# Altium project ESP_Dent.PrjPcb (part 2 of 3)
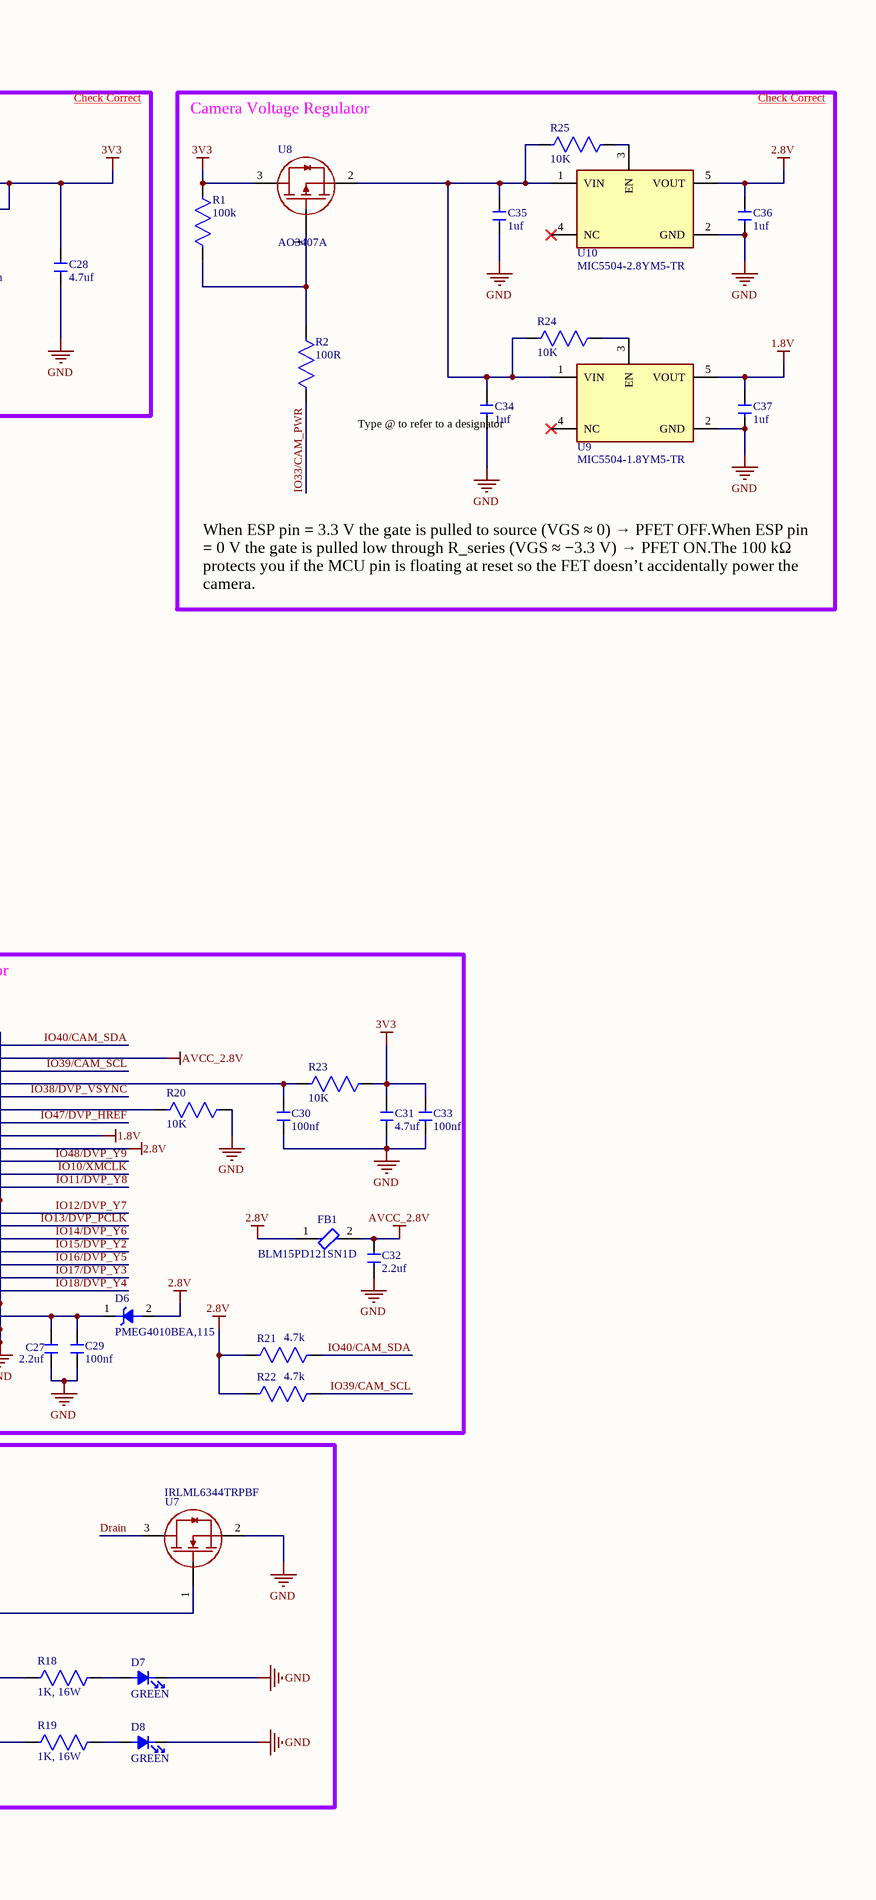
[diagram p2: Dent_Sheet_ESP.SchDoc, right]

## Sheet Dent_Sheet_ESP.SchDoc (continued)
### Library data of the parts
C1 C2 C9 C11 C12 C15-C17 C19 C21 C23 C24 C29 C30 C33 = 100nf: CAP CER 100NF 10V X7R 0402; Manufacturer: Samsung; Manufacturer Part Number: CL05B104KP5VPNC; Material: 4241ConductorMaterial; Tolerance: 10%; Supplier: Digikey; Supplier Part Number: 1276-CL05B104KP5VPNCCT-ND; RoHS: Yes; Category: Ceramic Capacitors; Stock: 98704; Pricing: 1=0.1, 10=0.037, 50=0.0248, 100=0.0212, 500=0.0159, 1000=0.01341, 2500=0.01148, 5000=0.01032 (USD); Case/Package: 343Case; Min Operating Temperature: -55°C; Max Operating Temperature: 125°C; Value: 100nF; Voltage Rating: 10V; Height: 550um; RoHS Compliant: Yes; LCSC Part No.: C16193311
C3 = CMP-2010-01082-2: Chip Multilayer Ceramic Capacitors for General Purpose, 0201, 1.1pF, C0G, 30ppm/°C, 0.1pF, 50V; Case/Package: 0201; Mount: Surface Mount; Max Operating Temperature: 125°C; Width: 0.3mm; Height: 0.3mm; Length: 0.024inch; Voltage Rating: 50V; Case Code (Metric): 0603; Package Quantity: 15000; Thickness: 0.013inch; Case Code (Imperial): 0201; Capacitance: 1.1pF; Packaging: Tape and Reel; Voltage Rating (DC): 50V; Min Operating Temperature: -55°C; Dielectric: C0G; Termination: SMD/SMT; LCSC Part No.: C384969; Value: 1.1pF
C4 = CMP-2010-00924-2: Ceramic Capacitor 0.9pF ±0.05pF 25V C0G 0201 (0603 Metric); Package Quantity: 15000; Dielectric: C0G; Voltage Rating: 25V; Voltage Rating (DC): 25V; Length: 0.024inch; Max Operating Temperature: 125°C; Case Code (Imperial): 0201; Width: 0.012inch; Termination: SMD/SMT; Mount: Surface Mount; Packaging: Tape and Reel; Radiation Hardening: No; Case/Package: 0201; Thickness: 0.013inch; Capacitance: 0.9pF; Case Code (Metric): 0603; Depth: 0.3mm; Height: 0.3mm; Min Operating Temperature: -55°C; LCSC Part No.: C471401; Value: 0.9pF
C7 C18 = 10nf: CAP CER 10000PF 50V X7R 0402; Manufacturer: Samsung; Manufacturer Part Number: CL05B103KB5NNNC; Material: Ceramic; Tolerance: 10%; Supplier: Digikey; Supplier Part Number: 1276-1028-1-ND; RoHS: Yes; Category: Ceramic Capacitors; Stock: 192666; Pricing: 1=0.08, 10=0.002 (USD); Mounting Technology: Surface Mount; Case/Package: 0402; Case Code (Metric): 1005; Case Code (Imperial): 0402; Min Operating Temperature: -55°C; Max Operating Temperature: 125°C; Packaging: Tape and Reel; Value: 10nF; Package Quantity: 1; Voltage Rating: 50V; Dielectric: X7R; Voltage: 50V; Series: CL; Construction: Flat; Voltage Rating (DC): 50V; Length: 1mm; Width: 0.02inch; Height: 0.5mm; Thickness: 0.022inch; Depth: 0.5mm; Radiation Hardening: No; RoHS Compliant: Yes; Lead Free: 5697LeadFree; ComponentLink1URL: https://datasheet.ciiva.com/15195/getdatasheetpartid-359682-15195636.pdf?src-supplier=Verical; ComponentLink1Description: https://datasheet.ciiva.com/15195/getdatasheetpartid-359682-15195636.pdf?src-supplier=Verical; ComponentLink2URL: https://datasheet.ciiva.com/29198/458761-da-01-en-vs-kondensator-0402-29198432.pdf?src-supplier=Conrad; ComponentLink2Description: https://datasheet.ciiva.com/29198/458761-da-01-en-vs-kondensator-0402-29198432.pdf?src-supplier=Conrad; ComponentLink3URL: https://datasheet.ciiva.com/26309/mlcc-catalogdownload2013-eng-26309005.pdf?src-supplier=Distrelec; ComponentLink3Description: https://datasheet.ciiva.com/26309/mlcc-catalogdownload2013-eng-26309005.pdf?src-supplier=Distrelec; LCSC Part No.: C15195
C8 C10 C14 C27 C32 = 2.2uf: CAP CER 2.2UF 10V X5R 0402; Manufacturer: Samsung; Manufacturer Part Number: CL05A225KP5NSNC; Material: 4241ConductorMaterial; Supplier: Digikey; Supplier Part Number: 1276-1108-1-ND; RoHS: Yes; Category: Ceramic Capacitors; Pricing: 1=0.13, 10=0.072, 50=0.0504, 100=0.0437, 500=0.0325, 1000=0.02908, 2500=0.02547, 5000=0.0233 (USD); ComponentLink1URL: https://datasheet.ciiva.com/26838/getdatasheetpartid-358634-26838179.pdf?src-supplier=Verical; ComponentLink1Description: https://datasheet.ciiva.com/26838/getdatasheetpartid-358634-26838179.pdf?src-supplier=Verical; ComponentLink2URL: https://datasheet.ciiva.com/25794/cl05a225kp5nsnc-25794439.pdf?src-supplier=Digikey; ComponentLink2Description: https://datasheet.ciiva.com/25794/cl05a225kp5nsnc-25794439.pdf?src-supplier=Digikey; LCSC Part No.: C107369
C13 C34-C37 = 1uf: CAP CER 1UF 25V X5R 0402; Manufacturer: Samsung; Manufacturer Part Number: CL05A105KA5NQNC; Dielectric Material: Ceramic; Multilayer: Yes; Tolerance  (fill in as +-): 10%; Supplier: Digikey; Supplier Part Number: 1276-1445-1-ND; RoHS: Yes; Category: Ceramic Capacitors; Stock: 704317; Pricing: 1=0.08, 10=0.03, 50=0.0214 (USD); Mounting Technology: Surface Mount; Pins: 2; Package Shape: Rectangular; Case/Package: 0402; Terminal Finish: Nickel; Min Operating Temperature: -55°C; Max Operating Temperature: 85°C; JESD-609 Code: e3; Value: 1uF; Capacitor Type: Ceramic; Package Style: SMTMeter; Packaging: Tape and Reel; Tolerance (fill in as +-): 10%; Rated DC Voltage (URdc): 25V; Temperature Characteristics Code: X5R; Termination: Wraparound; Length: 1mm; Width: 0.5mm; Height: 0.6mm; Reach SVHC Compliant: Yes; RoHS Compliant: Yes; ComponentLink1URL: https://datasheet.ciiva.com:443/pdfs/VipMasterIC/IC/SEMS/SEMS-S-A0008384515/SEMS-S-A0008872946-1.pdf?src-supplier=IHS+Markit; ComponentLink1Description: https://datasheet.ciiva.com:443/pdfs/VipMasterIC/IC/SEMS/SEMS-S-A0008384515/SEMS-S-A0008872946-1.pdf?src-supplier=IHS+Markit; ComponentLink2URL: https://datasheet.ciiva.com/25720/cl05a105ka5nqnc-25720771.pdf?src-supplier=Digikey; ComponentLink2Description: https://datasheet.ciiva.com/25720/cl05a105ka5nqnc-25720771.pdf?src-supplier=Digikey; ComponentLink3URL: https://datasheet.ciiva.com/3777/cl05a105ka5nqnc-3777709.pdf?src-supplier=Arrow+Electronics; ComponentLink3Description: https://datasheet.ciiva.com/3777/cl05a105ka5nqnc-3777709.pdf?src-supplier=Arrow+Electronics; ComponentLink4URL: https://datasheet.ciiva.com/29198/459147-da-01-en-vs-kondensator-0402-29198339.pdf?src-supplier=Conrad; ComponentLink4Description: https://datasheet.ciiva.com/29198/459147-da-01-en-vs-kondensator-0402-29198339.pdf?src-supplier=Conrad; LCSC Part No.: C52923
C20 C25 C28 C31 = 4.7uf: CAP CER 4.7UF 10V X5R 0402; Manufacturer: Samsung; Manufacturer Part Number: CL05A475KP5ZRNC; Supplier: DigiKey; Supplier Part Number: 1276-CL05A475KP5ZRNCCT-ND; RoHS: Yes; Stock: 56476; Pricing: 1=0.2, 10=0.114, 50=0.081, 100=0.0711, 500=0.05766, 1000=0.04912, 2500=0.04367, 5000=0.04039, 10000=0.035, 20000=0.03472, 30000=0.03435, 50000=0.03312, 70000=0.0324, 100000=0.0318 (USD); LCSC Part No.: C730428
C22 C26 = 24pf: CAP CER 24PF 50V C0G/NPO 0402; Manufacturer: Yageo; Manufacturer Part Number: CC0402GRNPO9BN240; Supplier: Digikey; Supplier Part Number: 311-3334-1-ND; RoHS: Yes; Category: Ceramic Capacitors; Stock: 9554; Pricing: 1=0.1, 10=0.041, 50=0.0278, 100=0.0239, 500=0.01724, 1000=0.0152, 2500=0.01306, 5000=0.01178 (USD); ComponentLink1URL: http://www.yageo.com/documents/recent/UPY-GP_NP0_16V-to-50V_16.pdf?src-supplier=Digikey; ComponentLink1Description: http://www.yageo.com/documents/recent/UPY-GP_NP0_16V-to-50V_16.pdf?src-supplier=Digikey; ComponentLink2URL: http://www.yageo.com/NewPortal/yageodocoutput?fileName=/pdf/MLCC/UPY-GP_NP0_16V-to-50V_14.pdf&src-supplier=Digikey; ComponentLink2Description: http://www.yageo.com/NewPortal/yageodocoutput?fileName=/pdf/MLCC/UPY-GP_NP0_16V-to-50V_14.pdf&src-supplier=Digikey; ComponentLink3URL: https://datasheet.octopart.com/CC0402GRNPO9BN240-Yageo-datasheet-178484655.pdf?src-supplier=Future+Electronics; ComponentLink3Description: https://datasheet.octopart.com/CC0402GRNPO9BN240-Yageo-datasheet-178484655.pdf?src-supplier=Future+Electronics; LCSC Part No.: C541417
CN1 = AFC01-S24FCC-00: SMD,P=0.5mm,Surface Mount,Right Angle; Manufacturer: Hirose; Connector Type: CARD EDGE CONNECTOR; Option: General Purpose; Filter Feature: No; Number of Rows Loaded: 1; Number of Contacts: 24; Supplier: Digikey; Supplier Part Number: AFC01-S24FCC-00; Manufacturer Part Number: AFC01-S24FCC-00; RoHS: Yes; Category: FFC / FPC; Stock: 2429; Pricing: 1=1.87, 10=1.59, 25=1.4904, 50=1.419, 100=1.3512, 250=1.26648, 500=1.20602, 1000=1.14846 (USD); Mounting Technology: Board; Contact Material: Copper Alloy; Contact Finish - Mating: GOLD; Contact Finish - Termination: GOLD; JESD-609 Code: e4; Contact Gender: Female; Mixed Contacts: No; Mounting Style: RIGHT ANGLE; Termination: SMD/SMT; Terminal Pitch: 0.5mm; Flammability Rating: UL94 V-0; DIN Conformance: No; IEC Conformance: No; MIL Conformance: No; RoHS Compliant: Yes; ComponentLink1URL: https://datasheet.ciiva.com:443/pdfs/VipMasterIC/IC/HIRO/HIRO-S-A0003371943/HIRO-S-A0003371943-1.pdf?src-supplier=IHS+Markit; ComponentLink1Description: https://datasheet.ciiva.com:443/pdfs/VipMasterIC/IC/HIRO/HIRO-S-A0003371943/HIRO-S-A0003371943-1.pdf?src-supplier=IHS+Markit; ComponentLink2URL: https://www.hirose.com/product/en/download_file/key_name/FH52-24S-0.5SH/category/Specification%20Sheet/doc_file_id/43519/?file_category_id=9&item_id=05803318500&is_series=&src-supplier=Digikey; ComponentLink2Description: https://www.hirose.com/product/en/download_file/key_name/FH52-24S-0.5SH/category/Specification%20Sheet/doc_file_id/43519/?file_category_id=9&item_id=05803318500&is_series=&src-supplier=Digikey; ComponentLink3URL: https://datasheet.octopart.com/FH52-24S-0.5SH-Hirose-datasheet-155997836.pdf?src-supplier=Future+Electronics; ComponentLink3Description: https://datasheet.octopart.com/FH52-24S-0.5SH-Hirose-datasheet-155997836.pdf?src-supplier=Future+Electronics; ComponentLink4URL: https://datasheet.octopart.com/FH52-24S-0.5SH-Hirose-datasheet-137334854.pdf?src-supplier=Sager+Electronics; ComponentLink4Description: https://datasheet.octopart.com/FH52-24S-0.5SH-Hirose-datasheet-137334854.pdf?src-supplier=Sager+Electronics; LCSC Part No.: C262276
D1 D6 = PMEG4010BEA,115: DIODE SCHOTTKY 40V 1A SOD323; Manufacturer: Nexperia; Package Body Material: Plastic; Diode Element Material: SILICON; Number of Elements: 1; Diode Type: RECTIFIER; Time @ Peak Reflow Temperature-Max (s): 40s; Qualification Status: Not Qualified; Supplier: Digikey; Supplier Part Number: 1727-5211-1-ND; Manufacturer Part Number: PMEG4010BEA,115; RoHS: Yes; Category: Schottky Diodes; Stock: 29096; Pricing: 1=0.29, 10=0.166, 100=0.1306, 500=0.09678, 1000=0.08581 (USD); Pins: 2; Package Shape: Rectangular; Terminal Finish: Tin; Max Operating Temperature: 150°C; JESD-609 Code: e3; JESD-30 Code: R-PDSO-G2; Package Style: SMALL OUTLINEMeter; Surface Mount: Yes; Terminal Form: Gull Wing; Terminal Position: DUAL; Moisture Sensitivity Level: 1; Max Output current: 1A; Peak Reflow Temperature (Cel): 260°C; Technology: SCHOTTKY; Reach SVHC Compliant: Yes; RoHS Compliant: Yes; ComponentLink1URL: https://datasheet.ciiva.com:443/pdfs/VipMasterIC/IC/PHGL/PHGLS19535/PHGLS19689-1.pdf?src-supplier=IHS+Markit; ComponentLink1Description: https://datasheet.ciiva.com:443/pdfs/VipMasterIC/IC/PHGL/PHGLS19535/PHGLS19689-1.pdf?src-supplier=IHS+Markit; ComponentLink2URL: http://www.farnell.com/datasheets/689588.pdf?src-supplier=Farnell; ComponentLink2Description: http://www.farnell.com/datasheets/689588.pdf?src-supplier=Farnell; ComponentLink3URL: https://datasheet.octopart.com/PMEG4010BEA%2C115-Nexperia-datasheet-142110124.pdf?src-supplier=Future+Electronics; ComponentLink3Description: https://datasheet.octopart.com/PMEG4010BEA%2C115-Nexperia-datasheet-142110124.pdf?src-supplier=Future+Electronics; ComponentLink4URL: https://datasheet.octopart.com/PMEG4010BEA%2C115-Nexperia-datasheet-180924740.pdf?src-supplier=Newark; ComponentLink4Description: https://datasheet.octopart.com/PMEG4010BEA%2C115-Nexperia-datasheet-180924740.pdf?src-supplier=Newark; LCSC Part No.: C36975
D2 = USBLC6-2SC6: 17V Clamp 5A (8/20µs) Ipp Tvs Diode Surface Mount SOT-23-6; Manufacturer: STMicroelectronics; Breakdown Voltage: 6V; Value: 2.5pF; Data Rate: 480Mbps; Direction: Unidirectional; Element Configuration: Dual; ESD Protection: Yes; Forward Voltage: 1.1V; Leakage Current: 150nA; Max Junction Temperature (Tj): 125°C; Max Repetitive Reverse Voltage (Vrrm): 5.25V; Number of Bidirectional Channels: 2; Number of Elements: 1; Reverse Standoff Voltage: 5V; Test Current: 1mA; Supplier: DigiKey; Supplier Part Number: 497-5235-1-ND; Manufacturer Part Number: USBLC6-2SC6; RoHS: Compliant; Category: TVS Diodes; Stock: 121944; Pricing: 1=0.36, 10=0.243, 100=0.163, 500=0.127, 1000=0.114 (USD); Case/Package: SOT-23; China RoHS: Compliant; Clamping Voltage: 17V; Contact Plating: Tin; Depth: 1.75mm; Height: 1.45mm; Lead Free: Lead Free; Length: 3.05mm; Lifecycle Status: Production; Max Breakdown Voltage: 6V; Max Operating Temperature: 125°C; Max Reverse Leakage Current: 150nA; Min Breakdown Voltage: 6V; Min Operating Temperature: -40°C; Mounting Technology: Surface Mount; Number of Channels: 2; Pins: 6; Number of Terminals: 6; Operating Supply Voltage: 1.1V; Peak Pulse Current: 5A; Peak Reverse Current: 150nA; Polarity: Unidirectional; Power Line Protection: Yes; Radiation Hardening: No; REACH SVHC: Yes; Reverse Breakdown Voltage: 6V; Schedule B: 8536300000, 8536300000|8536300000|8536300000|8536300000|8536300000|8536300000|8536300000|8536300000|8536300000|8536300000|8536300000|8536300000|8536300000|8536300000|8536300000|8536300000|8536300000|8536300000|8536300000|8536300000|8536300000|8536300000|8536300000|85; Termination: SMD/SMT; Width: 1.75mm; Working Voltage: 5V; ComponentLink1URL: https://datasheet.octopart.com:443/USBLC6-2SC6-STMicroelectronics-datasheet-10412581.pdf?src-supplier=Newark; ComponentLink1Description: https://datasheet.octopart.com:443/USBLC6-2SC6-STMicroelectronics-datasheet-10412581.pdf?src-supplier=Newark; ComponentLink2URL: https://datasheet.octopart.com:443/USBLC6-2SC6-STMicroelectronics-datasheet-181961833.pdf?src-supplier=Newark; ComponentLink2Description: https://datasheet.octopart.com:443/USBLC6-2SC6-STMicroelectronics-datasheet-181961833.pdf?src-supplier=Newark; ComponentLink3URL: https://datasheet.octopart.com:443/USBLC6-2SC6-STMicroelectronics-datasheet-525477.pdf?src-supplier=Factory+Futures; ComponentLink3Description: https://datasheet.octopart.com:443/USBLC6-2SC6-STMicroelectronics-datasheet-525477.pdf?src-supplier=Factory+Futures; ComponentLink4URL: https://datasheet.octopart.com:443/USBLC6-2SC6-STMicroelectronics-datasheet-82998616.pdf?src-supplier=Farnell; ComponentLink4Description: https://datasheet.octopart.com:443/USBLC6-2SC6-STMicroelectronics-datasheet-82998616.pdf?src-supplier=Farnell; ComponentLink5URL: https://datasheet.octopart.com:443/USBLC6-2SC6-STMicroelectronics-datasheet-46285.pdf?src-supplier=Farnell; ComponentLink5Description: https://datasheet.octopart.com:443/USBLC6-2SC6-STMicroelectronics-datasheet-46285.pdf?src-supplier=Farnell; ComponentLink6URL: https://datasheet.octopart.com:443/USBLC6-2SC6-STMicroelectronics-datasheet-14050643.pdf?src-supplier=iiiC; ComponentLink6Description: https://datasheet.octopart.com:443/USBLC6-2SC6-STMicroelectronics-datasheet-14050643.pdf?src-supplier=iiiC; ComponentLink7URL: https://datasheet.octopart.com:443/USBLC6-2SC6-STMicroelectronics-datasheet-10521292.pdf?src-supplier=Jameco; ComponentLink7Description: https://datasheet.octopart.com:443/USBLC6-2SC6-STMicroelectronics-datasheet-10521292.pdf?src-supplier=Jameco; LCSC Part No.: C7519
D3 D7 D8 = VLMG1500-GS08: LED YLW-GRN 0402 SMD; Manufacturer: Vishay; Color: Green,Yellow; Shape: Rectangular; Forward Current: 30mA; Forward Voltage: 2.4V; Luminous Intensity-Nom: 90mcd; Channels: 1; Optoelectronic Device Type: SINGLE COLOR LED; Reverse Voltage-Max: 5V; Viewing Angle: 130°; Overall Height: 0.35mm; Supplier: Digikey; Supplier Part Number: VLMG1500-GS08CT-ND; Manufacturer Part Number: VLMG1500-GS08; RoHS: Yes; Category: LEDs; Stock: 234660; Pricing: 1=0.24, 10=0.164, 100=0.1147, 500=0.09218, 1000=0.0847 (USD); Mounting Technology: Surface Mount; Pins: 2; Color@wavelength: Green; Min Operating Temperature: -30°C; Max Operating Temperature: 85°C; Packaging: Tape and Reel; Size: 0.5mm; Terminal Pitch: 0.95mm; Reach SVHC Compliant: Yes; RoHS Compliant: Yes; ComponentLink1URL: https://datasheet.ciiva.com:443/pdfs/VipMasterIC/IC/VISH/VISH-S-A0003457490/VISH-S-A0003457490-1.pdf?src-supplier=IHS+Markit; ComponentLink1Description: https://datasheet.ciiva.com:443/pdfs/VipMasterIC/IC/VISH/VISH-S-A0003457490/VISH-S-A0003457490-1.pdf?src-supplier=IHS+Markit; ComponentLink2URL: https://datasheet.ciiva.com/12071/vlmo1500-244705-12071911.pdf?src-supplier=Mouser; ComponentLink2Description: https://datasheet.ciiva.com/12071/vlmo1500-244705-12071911.pdf?src-supplier=Mouser; ComponentLink3URL: https://datasheet.ciiva.com/30005/vlmo1500-30005134.pdf?src-supplier=Avnet; ComponentLink3Description: https://datasheet.ciiva.com/30005/vlmo1500-30005134.pdf?src-supplier=Avnet; LCSC Part No.: C511404
FB1 = BLM15PD121SN1D: Chip Ferrite Bead, 0402, 120Ω @ 100MHz, 0.09Ω, 25%, 1.3A; Impedance: 120R; Material: Steel; Number of Lines: 1; DC Resistance (DCR): 90mR; Number of Pins: 2; Military Standard: Not; Width: 0.5mm; Depth: 0.55mm; Lead Free: Lead Free; Test Frequency: 100MHz; Case Code (Metric): 1005; Case Code (Imperial): 0402; Current Rating: 1.3A; Package Quantity: 1; Height: 0.5mm; Radiation Hardening: No; Tolerance: 25%; Max DC Current: 1.3A; Packaging: Tape and Reel; REACH SVHC: No SVHC; Case/Package: 0402; Min Operating Temperature: -55°C; Max Current Rating: 1.3A; Length: 1mm; Number of Circuits: 1; Core Material: Ferrite; Max Operating Temperature: 125°C; Termination: SMD/SMT; DC Current: 1.3A; LCSC Part No.: C76891
J1 = 217179-0001: USB Connector, USB Type C, USB 2.0, Receptacle, 16 Ways, Surface Mount, Through Hole Mount; Manufacturer: Molex; Contact Resistance: 50mΩ; Current Rating: 1.25A; Dielectric Material: Polyamide; Insulation Resistance: 100MΩ; Number of Contacts: 16; Number of Ports: 1; USB Standard: USB 2.0; Voltage Rating: 30V; Supplier: DigiKey; Supplier Part Number: 900-2171790001DKR-ND; Manufacturer Part Number: 217179-0001; RoHS: Compliant; Category: USB Connectors; Stock: 10151; Pricing: 1=0.83, 10=0.704, 25=0.6596, 50=0.628, 100=0.598, 250=0.56052, 500=0.53374 (USD); Contact Gender: Female; Contact Material: Gold, Nickel; Gender: Receptacle; Height: 3.36mm; Lifecycle Status: Production; Max Operating Temperature: 85°C; Min Operating Temperature: -40°C; Pins: 16; Number of Rows: 1; REACH SVHC: Yes; Shell Finish: Nickel; Shell Material: Stainless Steel; Terminal Pitch: 500µm; ComponentLink1URL: https://datasheet.octopart.com:443/217179-0001-Molex-datasheet-158871109.pdf?src-supplier=ODG+(Origin+Data+Global); ComponentLink1Description: https://datasheet.octopart.com:443/217179-0001-Molex-datasheet-158871109.pdf?src-supplier=ODG+(Origin+Data+Global); ComponentLink2URL: https://sigma.octopart.com:443/158871110/technical_drawing/Molex-217179-0001.pdf?src-supplier=Upverter; ComponentLink2Description: https://sigma.octopart.com:443/158871110/technical_drawing/Molex-217179-0001.pdf?src-supplier=Upverter; ComponentLink3URL: https://datasheet.octopart.com:443/217179-0001-Molex-datasheet-164573281.pdf?src-supplier=RS+(Formerly+Allied+Electronics); ComponentLink3Description: https://datasheet.octopart.com:443/217179-0001-Molex-datasheet-164573281.pdf?src-supplier=RS+(Formerly+Allied+Electronics); ComponentLink4URL: http://sigma.octopart.com:80/reach_statement/Molex-company-74.pdf?src-supplier=Compliance+Statements; ComponentLink4Description: http://sigma.octopart.com:80/reach_statement/Molex-company-74.pdf?src-supplier=Compliance+Statements; ComponentLink5URL: http://sigma.octopart.com:80/rohs_statement/Molex-company-73.pdf?src-supplier=Compliance+Statements; ComponentLink5Description: http://sigma.octopart.com:80/rohs_statement/Molex-company-73.pdf?src-supplier=Compliance+Statements; ComponentLink6URL: http://sigma.octopart.com:80/conflict_mineral_statement/Molex-company-72.pdf?src-supplier=Compliance+Statements; ComponentLink6Description: http://sigma.octopart.com:80/conflict_mineral_statement/Molex-company-72.pdf?src-supplier=Compliance+Statements; LCSC Part No.: C3197684
J2 = U.FL-R-SMT-1(80): U.FL (UMCC) Connector Receptacle, Male Pin 50 Ohms Surface Mount Solder; Package: None; Price: None; Value: *; MP: U.FL-R-SMT-1(80); Availability: Unavailable; LCSC Part No.: C88374; ComponentLink1Description: Link; ComponentLink1URL: C88374
J3 = AFA01-S06FCC-00: Pitch 1.00mm FPC Connector SMT Type; MF: Shenzhen Jushuo Electronics Co; SnapEDA_Link: https://www.snapeda.com/parts/AFA01-S06FCC-00/Shenzhen+Jushuo+Electronics+Co/view-part/?ref=snap; Package: Package; Value: *; MP: AFA01-S06FCC-00; Check_prices: https://www.snapeda.com/parts/AFA01-S06FCC-00/Shenzhen+Jushuo+Electronics+Co/view-part/?ref=eda; LCSC Part No.: C262262
L1 = CMP-06042-004543-1: Film type RF Inductor 2.3nH ±0.1nH 600mA 0.12Ω 0201 (0603); DC Resistance (DCR): 120mR; Test Frequency: 500MHz; Shielding: Unshielded; Core Material: Non-Magnetic; Self Resonant Frequency: 9GHz; Case Code (Metric): 0603; Min Operating Temperature: -55°C; Max Operating Temperature: 125°C; Case Code (Imperial): 0201; Mount: Surface Mount; Case/Package: 0201; Current Rating: 600mA; Inductance: 2.3nH; Packaging: Cut Tape; Resistor Type: Thin Film; LCSC Part No.: C2975186; Value: 2.3nH
L2 = LQG15HS2N0S02D: Inductor RF Chip Multi-Layer 2nH 0.3nH 100MHz 8Q-Factor Air 300mA 100mOhm DCR 0402 Paper T/R; Manufacturer: Murata; Manufacturer Lifecycle Status: IN PRODUCTION; Current Rating: 900mA; DC Resistance (DCR): 90mΩ; Number of Circuits: 1; Q Factor: 8; Self Resonant Frequency: 6GHz; Shielding: No; Tolerance: 15%; Supplier: DigiKey; Supplier Part Number: 490-6569-1-ND; Manufacturer Part Number: LQG15HS2N0S02D; RoHS: Compliant; Category: Fixed Inductors; Stock: 58770; Pricing: 1=0.1, 10=0.036, 100=0.0298, 1000=0.02454, 5000=0.0214 (USD); Case/Package: 0402; Case Code (Imperial): 0402; Case Code (Metric): 1005; Core Material: Air; Current: 300mA; DC Current: 300mA; Depth: 550µm; Height: 500µm; Height - Seated (Max): 558.8µm; Value: 2nH; Lead Free: Contains Lead; Length: 1mm; Lifecycle Status: Production; Max Current Rating: 900mA; Max DC Current: 300mA; Max Operating Temperature: 125°C; Military Standard: Not; Min Operating Temperature: -55°C; Pins: 2; Number of Terminals: 2; Radiation Hardening: No; REACH SVHC: Yes; RMS Current (Irms): 900mA; Schedule B: 8504500000, 8504500000|8504500000|8504500000|8504500000|8504500000; ESR: 90mΩ; Termination: SMD/SMT; Test Frequency: 100MHz; Width: 500µm; ComponentLink1URL: https://datasheet.octopart.com:443/LQG15HS2N0S02D-Murata-datasheet-11550074.pdf?src-supplier=Upverter; ComponentLink1Description: https://datasheet.octopart.com:443/LQG15HS2N0S02D-Murata-datasheet-11550074.pdf?src-supplier=Upverter; ComponentLink2URL: https://datasheet.octopart.com:443/LQG15HS2N0S02D-Murata-datasheet-501917.pdf?src-supplier=Upverter; ComponentLink2Description: https://datasheet.octopart.com:443/LQG15HS2N0S02D-Murata-datasheet-501917.pdf?src-supplier=Upverter; ComponentLink3URL: https://datasheet.octopart.com:443/LQG15HS2N0S02D-Murata-datasheet-104420594.pdf?src-supplier=element14+APAC; ComponentLink3Description: https://datasheet.octopart.com:443/LQG15HS2N0S02D-Murata-datasheet-104420594.pdf?src-supplier=element14+APAC; ComponentLink4URL: https://datasheet.octopart.com:443/LQG15HS2N0S02D-Murata-datasheet-166148638.pdf?src-supplier=TME; ComponentLink4Description: https://datasheet.octopart.com:443/LQG15HS2N0S02D-Murata-datasheet-166148638.pdf?src-supplier=TME; ComponentLink5URL: https://datasheet.octopart.com:443/LQG15HS2N0S02D-Murata-datasheet-140712221.pdf?src-supplier=Ciiva; ComponentLink5Description: https://datasheet.octopart.com:443/LQG15HS2N0S02D-Murata-datasheet-140712221.pdf?src-supplier=Ciiva; ComponentLink6URL: https://datasheet.octopart.com:443/LQG15HS2N0S02D-Murata-datasheet-138753340.pdf?src-supplier=Ciiva; ComponentLink6Description: https://datasheet.octopart.com:443/LQG15HS2N0S02D-Murata-datasheet-138753340.pdf?src-supplier=Ciiva; ComponentLink7URL: https://datasheet.octopart.com:443/LQG15HS2N0S02D-Murata-datasheet-142295944.pdf?src-supplier=Arrow.cn; ComponentLink7Description: https://datasheet.octopart.com:443/LQG15HS2N0S02D-Murata-datasheet-142295944.pdf?src-supplier=Arrow.cn; ComponentLink8URL: https://datasheet.octopart.com:443/LQG15HS2N0S02D-Murata-datasheet-145449626.pdf?src-supplier=Geoflip; ComponentLink8Description: https://datasheet.octopart.com:443/LQG15HS2N0S02D-Murata-datasheet-145449626.pdf?src-supplier=Geoflip; ComponentLink9URL: https://datasheet.octopart.com/LQG15HS2N0S02D-Murata-datasheet-14395927.pdf; ComponentLink9Description: https://datasheet.octopart.com/LQG15HS2N0S02D-Murata-datasheet-14395927.pdf; ComponentLink10URL: https://datasheet.octopart.com:443/LQG15HS2N0S02D-Murata-datasheet-44660258.pdf?src-supplier=Future+Electronics; ComponentLink10Description: https://datasheet.octopart.com:443/LQG15HS2N0S02D-Murata-datasheet-44660258.pdf?src-supplier=Future+Electronics; ComponentLink11URL: http://sigma.octopart.com:80/reach_statement/Murata-company-16.pdf?src-supplier=Compliance+Statements; ComponentLink11Description: http://sigma.octopart.com:80/reach_statement/Murata-company-16.pdf?src-supplier=Compliance+Statements; LCSC Part No.: C18216
L3 = 24nH: FIXED IND 24NH 280MA 0.52OHM SMD; Manufacturer: Murata; Manufacturer Part Number: LQW15AN24NJ00D; Core Material: Alumina; Tolerance: 5%; Case/Size Code: 0402; DC Resistance (DCR): 520mR; Inductance-Nom (L): 0.024uH; Inductor Application: RF INDUCTOR; Inductor Type: GENERAL PURPOSE INDUCTOR; Channels: 1; Quality Factor-Min (at L-nom): 25; Self Resonant Frequency: 3.5GHz; Shape/Size Description: RECTANGULAR PACKAGE; Shielding: Unshielded; Test Frequency: 100MHz; Package Height: 0.5mm; Package Length: 1mm; Supplier: Digikey; Supplier Part Number: 490-6791-1-ND; RoHS: Yes; Category: Fixed Inductors; Stock: 37965; Pricing: 1=0.1, 10=0.086, 100=0.071, 1000=0.0584, 5000=0.05094 (USD); Pins: 2; Terminal Finish: Nickel; Min Operating Temperature: -55°C; Max Operating Temperature: 125°C; JESD-609 Code: e3; Construction: Wirewound Chip; Package Style: SMTMeter; Packaging: Tape and Reel; Max Current Rating: 280mA; Surface Mount: Yes; Terminal Placement: Dual Ended; Termination: One Surface; Package Width: 0.5mm; Reach SVHC Compliant: Yes; RoHS Compliant: Yes; ComponentLink1URL: https://datasheet.ciiva.com:443/pdfs/VipMasterIC/IC/MURE/MURE-S-A0004305562/MURE-S-A0004305562-1.pdf?src-supplier=IHS+Markit; ComponentLink1Description: https://datasheet.ciiva.com:443/pdfs/VipMasterIC/IC/MURE/MURE-S-A0004305562/MURE-S-A0004305562-1.pdf?src-supplier=IHS+Markit; ComponentLink2URL: https://datasheet.ciiva.com/30489/0900766b8125623e-30489009.pdf?src-supplier=Rs; ComponentLink2Description: https://datasheet.ciiva.com/30489/0900766b8125623e-30489009.pdf?src-supplier=Rs; ComponentLink3URL: https://datasheet.ciiva.com/6709/l0075s0080lqw15a-00-6709996.pdf?src-supplier=Digikey; ComponentLink3Description: https://datasheet.ciiva.com/6709/l0075s0080lqw15a-00-6709996.pdf?src-supplier=Digikey; ComponentLink4URL: https://datasheet.ciiva.com/6709/l0075s0080lqw15a-00-6709997.pdf?src-supplier=Digikey; ComponentLink4Description: https://datasheet.ciiva.com/6709/l0075s0080lqw15a-00-6709997.pdf?src-supplier=Digikey; ComponentLink5URL: https://datasheet.ciiva.com/6709/l0075s0080lqw15a-00-6709998.pdf?src-supplier=Digikey; ComponentLink5Description: https://datasheet.ciiva.com/6709/l0075s0080lqw15a-00-6709998.pdf?src-supplier=Digikey; LCSC Part No.: C341784
L4 = 1uH: 1 µH Shielded Drum Core, Wirewound Inductor 3.1 A 70mOhm Max 0806 (2016 Metric); Manufacturer: Murata; Manufacturer Part Number: DFE201610P-1R0M=P2; Core Material: Metal; Tolerance: 20%; DC Resistance (DCR): 70mR; Inductor Type: GENERAL PURPOSE INDUCTOR; Channels: 1; Max Current Rating: 2.2A; Shape/Size Description: RECTANGULAR PACKAGE; Test Frequency: 1MHz; Supplier: Digikey; Supplier Part Number: 490-10607-1-ND; RoHS: Yes; Category: Fixed Inductors; Stock: 1407; Pricing: 1=0.21, 10=0.177, 100=0.1454, 1000=0.11957 (USD); Pins: 2; Min Operating Temperature: -40°C; Max Operating Temperature: 125°C; Inductance-Nom (L): 1uH; Shielding: Shielded; Surface Mount: Yes; Terminal Placement: Dual Ended; Termination: Wraparound; Reach SVHC Compliant: Yes; RoHS Compliant: Yes; ComponentLink1URL: https://psearch.en.murata.com:443/inductor/product/DFE201610P-1R0M_.pdf?src-supplier=IHS+Markit; ComponentLink1Description: https://psearch.en.murata.com:443/inductor/product/DFE201610P-1R0M_.pdf?src-supplier=IHS+Markit; ComponentLink2URL: http://www.farnell.com/datasheets/2550117.pdf?src-supplier=Farnell; ComponentLink2Description: http://www.farnell.com/datasheets/2550117.pdf?src-supplier=Farnell; ComponentLink3URL: https://www.murata.com/~/media/webrenewal/products/inductor/chip/tokoproducts/wirewoundmetalalloychiptype/m_dfe201610p.ashx?src-supplier=Digikey; ComponentLink3Description: https://www.murata.com/~/media/webrenewal/products/inductor/chip/tokoproducts/wirewoundmetalalloychiptype/m_dfe201610p.ashx?src-supplier=Digikey; ComponentLink4URL: http://www.murata.com/~/media/webrenewal/products/inductor/chip/tokoproducts/wirewoundmetalalloychiptype/m_dfe201610p.ashx?src-supplier=Digikey; ComponentLink4Description: http://www.murata.com/~/media/webrenewal/products/inductor/chip/tokoproducts/wirewoundmetalalloychiptype/m_dfe201610p.ashx?src-supplier=Digikey; ComponentLink5URL: http://www.toko.co.jp/products/pdf/inductors/dfe201610p.pdf?src-supplier=Avnet; ComponentLink5Description: http://www.toko.co.jp/products/pdf/inductors/dfe201610p.pdf?src-supplier=Avnet; ComponentLink6URL: https://datasheet.octopart.com/DFE201610P-1R0M%3DP2-Murata-datasheet-62290036.pdf?src-supplier=Element14; ComponentLink6Description: https://datasheet.octopart.com/DFE201610P-1R0M%3DP2-Murata-datasheet-62290036.pdf?src-supplier=Element14; LCSC Part No.: C882953
P1 = S2B-PH-SM4-TB: Header S2B-PH-SM4-TB, 2.00mm, 2-contacts, side entry, SMT, /1000/reel; Manufacturer: JST; Supplier: Digikey; Supplier Part Number: 455-S2B-PH-SM4-TBCT-ND; Manufacturer Part Number: S2B-PH-SM4-TB; RoHS: Yes; Stock: 12093; Pricing: 1=0.48, 10=0.409, 100=0.3477, 500=0.31032 (USD); LCSC Part No.: C295747
R1 R3 = 100k: RES 100K OHM 1% 1/16W 0402; Manufacturer: Yageo; Manufacturer Part Number: RC0402FR-07100KL; Additional Feature: LASER TRIMMABLE; Power: 62.5mW; Rated Temperature: 70°C; Value: 100kR; Working Voltage: 50V; Temperature Coefficient (ppm/Cel): 100; Package Height: 0.35mm; Package Length: 1mm; Package Width: 0.5mm; Supplier: Digikey; Supplier Part Number: 311-100KLRCT-ND; RoHS: Yes; Category: Chip SMD Resistors; Pricing: 1=0.1, 10=0.011, 25=0.01, 50=0.0092, 100=0.0071, 250=0.00308, 10000=0.00204, 20000=0.002, 30000=0.00196, 50000=0.00182, 70000=0.00181 (USD); Mounting Technology: Surface Mount; Pins: 2; Package Shape: Rectangular; Case/Package: 0402; Terminal Finish: Nickel; Min Operating Temperature: -55°C; Max Operating Temperature: 155°C; Tolerance: 1%; JESD-609 Code: e3; Resistor Type: FIXED RESISTOR; Construction: Chip; Packaging: Tape and Reel; Technology: METAL GLAZE/THICK FILM; Termination: Wraparound; Reach SVHC Compliant: Yes; RoHS Compliant: Yes; ComponentLink1URL: https://datasheet.ciiva.com:443/pdfs/VipMasterIC/IC/YAGO/YAGO-S-A0008145938/YAGO-S-A0008145938-1.pdf?src-supplier=IHS+Markit; ComponentLink1Description: https://datasheet.ciiva.com:443/pdfs/VipMasterIC/IC/YAGO/YAGO-S-A0008145938/YAGO-S-A0008145938-1.pdf?src-supplier=IHS+Markit; ComponentLink2URL: https://datasheet.ciiva.com/11819/0900766b80c66297-11819452.pdf?src-supplier=Rs; ComponentLink2Description: https://datasheet.ciiva.com/11819/0900766b80c66297-11819452.pdf?src-supplier=Rs; ComponentLink3URL: https://datasheet.ciiva.com/12667/pyu-rc0402-51-rohs-l-6-r-12667930.pdf?src-supplier=Mouser; ComponentLink3Description: https://datasheet.ciiva.com/12667/pyu-rc0402-51-rohs-l-6-r-12667930.pdf?src-supplier=Mouser; ComponentLink4URL: https://datasheet.ciiva.com/15189/getdatasheetpartid-323696-15189334.pdf?src-supplier=Verical; ComponentLink4Description: https://datasheet.ciiva.com/15189/getdatasheetpartid-323696-15189334.pdf?src-supplier=Verical; ComponentLink5URL: https://datasheet.ciiva.com/22747/1018594-22747509.pdf?src-supplier=Element14; ComponentLink5Description: https://datasheet.ciiva.com/22747/1018594-22747509.pdf?src-supplier=Element14; ComponentLink6URL: https://datasheet.ciiva.com/2453/pyu-r-int-thick-7-2453362.pdf?src-supplier=Digikey; ComponentLink6Description: https://datasheet.ciiva.com/2453/pyu-r-int-thick-7-2453362.pdf?src-supplier=Digikey; ComponentLink7URL: https://datasheet.ciiva.com/2453/pyu-r-int-thick-7-2453363.pdf?src-supplier=Digikey; ComponentLink7Description: https://datasheet.ciiva.com/2453/pyu-r-int-thick-7-2453363.pdf?src-supplier=Digikey; ComponentLink8URL: https://datasheet.ciiva.com/2453/pyu-r-int-thick-7-2453361.pdf?src-supplier=Digikey; ComponentLink8Description: https://datasheet.ciiva.com/2453/pyu-r-int-thick-7-2453361.pdf?src-supplier=Digikey; LCSC Part No.: C60491
R2 = 100R: Fixed Resistor, Metal Glaze/thick Film, 0.0625W, 100000ohm, 50V, 5% +/-Tol, 100ppm/Cel, Surface Mount, 0402; Manufacturer: Yageo; Manufacturer Part Number: RC0402JR-07100KL; Additional Feature: LASER TRIMMABLE; Power: 62.5mW; Rated Temperature: 70°C; Value: 100kR; Temperature Coefficient (ppm/Cel): 100; Package Height: 0.35mm; Package Length: 1mm; Package Width: 0.5mm; Supplier: Digikey; Supplier Part Number: 311-100KJRCT-ND; RoHS: Yes; Category: Chip SMD Resistors; Stock: 4938369; Pricing: 1=0.1, 10=0.006, 25=0.0056, 50=0.005, 100=0.0042, 250=0.00284, 10000=0.00204, 20000=0.00202, 50000=0.00187, 70000=0.00178, 100000=0.00169, 120000=0.00166, 240000=0.00153, 250000=0.00152 (USD); Mounting Technology: Surface Mount; Pins: 2; Package Shape: Rectangular; Case/Package: 0402; Terminal Finish: Nickel; Min Operating Temperature: -55°C; Max Operating Temperature: 155°C; Tolerance: 5%; JESD-609 Code: e3; Resistor Type: FIXED RESISTOR; Construction: Chip; Packaging: Tape and Reel; Technology: METAL GLAZE/THICK FILM; Termination: Wraparound; Working Voltage: 50V; Reach SVHC Compliant: Yes; RoHS Compliant: Yes; ComponentLink1URL: https://datasheet.ciiva.com:443/pdfs/VipMasterIC/IC/YAGO/YAGO-S-A0008145938/YAGO-S-A0008145938-1.pdf?src-supplier=IHS+Markit; ComponentLink1Description: https://datasheet.ciiva.com:443/pdfs/VipMasterIC/IC/YAGO/YAGO-S-A0008145938/YAGO-S-A0008145938-1.pdf?src-supplier=IHS+Markit; ComponentLink2URL: https://datasheet.ciiva.com/12668/pyu-rc0402-51-rohs-l-6-r-12668218.pdf?src-supplier=Mouser; ComponentLink2Description: https://datasheet.ciiva.com/12668/pyu-rc0402-51-rohs-l-6-r-12668218.pdf?src-supplier=Mouser; ComponentLink3URL: https://datasheet.ciiva.com/7850/1018594-7850133.pdf?src-supplier=Element14; ComponentLink3Description: https://datasheet.ciiva.com/7850/1018594-7850133.pdf?src-supplier=Element14; ComponentLink4URL: https://datasheet.ciiva.com/17052/pyu-rc0402-51-rohs-l-6-r-17052137.pdf?src-supplier=Future+Electronics; ComponentLink4Description: https://datasheet.ciiva.com/17052/pyu-rc0402-51-rohs-l-6-r-17052137.pdf?src-supplier=Future+Electronics; ComponentLink5URL: https://datasheet.ciiva.com/46394/1018594-46394941.pdf?src-supplier=Element14; ComponentLink5Description: https://datasheet.ciiva.com/46394/1018594-46394941.pdf?src-supplier=Element14; ComponentLink6URL: https://datasheet.ciiva.com/2491/pyu-r-int-thick-7-2491208.pdf?src-supplier=Digikey; ComponentLink6Description: https://datasheet.ciiva.com/2491/pyu-r-int-thick-7-2491208.pdf?src-supplier=Digikey; ComponentLink7URL: https://datasheet.ciiva.com/2491/pyu-r-int-thick-7-2491209.pdf?src-supplier=Digikey; ComponentLink7Description: https://datasheet.ciiva.com/2491/pyu-r-int-thick-7-2491209.pdf?src-supplier=Digikey; ComponentLink8URL: https://datasheet.ciiva.com/2491/pyu-r-int-thick-7-2491207.pdf?src-supplier=Digikey; ComponentLink8Description: https://datasheet.ciiva.com/2491/pyu-r-int-thick-7-2491207.pdf?src-supplier=Digikey; LCSC Part No.: C106234
R4 R5 = 5.1K: Fixed Resistor, Metal Glaze/thick Film, 0.0625W, 5100ohm, 50V, 1% +/-Tol, 100ppm/Cel, Surface Mount, 0402; Manufacturer: Yageo; Manufacturer Part Number: RC0402FR-075K1L; Additional Feature: LASER TRIMMABLE; Power: 62.5mW; Rated Temperature: 70°C; Value: 5.1kR; Temperature Coefficient (ppm/Cel): 100; Package Height: 0.35mm; Package Length: 1mm; Package Width: 0.5mm; Supplier: Digikey; Supplier Part Number: 311-5.10KLRCT-ND; RoHS: Yes; Category: Chip SMD Resistors; Stock: 654253; Pricing: 1=0.1, 10=0.008, 25=0.0072, 50=0.0062, 100=0.0056, 250=0.00308, 1000=0.0051, 2500=0.00408, 10000=0.00204, 20000=0.002, 30000=0.00196, 50000=0.00182, 70000=0.00181 (USD); Mounting Technology: Surface Mount; Pins: 2; Package Shape: Rectangular; Case/Package: 0402; Terminal Finish: Nickel; Min Operating Temperature: -55°C; Max Operating Temperature: 155°C; Tolerance: 1%; JESD-609 Code: e3; Resistor Type: FIXED RESISTOR; Construction: Chip; Packaging: Tape and Reel; Technology: METAL GLAZE/THICK FILM; Termination: Wraparound; Working Voltage: 50V; Reach SVHC Compliant: Yes; RoHS Compliant: Yes; ComponentLink1URL: https://datasheet.ciiva.com:443/pdfs/VipMasterIC/IC/YAGO/YAGO-S-A0008145938/YAGO-S-A0008145938-1.pdf?src-supplier=IHS+Markit; ComponentLink1Description: https://datasheet.ciiva.com:443/pdfs/VipMasterIC/IC/YAGO/YAGO-S-A0008145938/YAGO-S-A0008145938-1.pdf?src-supplier=IHS+Markit; LCSC Part No.: C3710326
R6 R7 R21 R22 = 4.7k: RES 4.7K OHM 1% 1/16W 0402; Manufacturer: Yageo; Manufacturer Part Number: RC0402FR-074K7L; Additional Feature: LASER TRIMMABLE; Power: 62.5mW; Rated Temperature: 70°C; Value: 4.7kR; Working Voltage: 50V; Temperature Coefficient (ppm/Cel): 100; Package Height: 0.35mm; Package Length: 1mm; Package Width: 0.5mm; Supplier: Digikey; Supplier Part Number: 311-4.7KLRCT-ND; RoHS: Yes; Category: Chip SMD Resistors; Stock: 643889; Pricing: 1=0.1, 10=0.02, 25=0.014, 50=0.0112, 100=0.009, 250=0.00688, 500=0.00566, 1000=0.00474, 2500=0.00381, 5000=0.00328, 10000=0.00286, 20000=0.00253, 30000=0.00237, 50000=0.0022, 70000=0.0021, 100000=0.002, 120000=0.00196, 240000=0.00182, 250000=0.00181 (USD); Mounting Technology: Surface Mount; Pins: 2; Package Shape: Rectangular; Case/Package: 0402; Terminal Finish: Nickel; Min Operating Temperature: -55°C; Max Operating Temperature: 155°C; Tolerance: 1%; JESD-609 Code: e3; Resistor Type: FIXED RESISTOR; Construction: Chip; Packaging: Tape and Reel; Technology: METAL GLAZE/THICK FILM; Termination: Wraparound; Reach SVHC Compliant: Yes; RoHS Compliant: Yes; ComponentLink1URL: https://datasheet.ciiva.com:443/pdfs/VipMasterIC/IC/YAGO/YAGO-S-A0008145938/YAGO-S-A0008145938-1.pdf?src-supplier=IHS+Markit; ComponentLink1Description: https://datasheet.ciiva.com:443/pdfs/VipMasterIC/IC/YAGO/YAGO-S-A0008145938/YAGO-S-A0008145938-1.pdf?src-supplier=IHS+Markit; ComponentLink2URL: https://datasheet.ciiva.com/22661/1686128-22661342.pdf?src-supplier=Element14; ComponentLink2Description: https://datasheet.ciiva.com/22661/1686128-22661342.pdf?src-supplier=Element14; ComponentLink3URL: https://datasheet.ciiva.com/7850/1018594-7850022.pdf?src-supplier=Element14; ComponentLink3Description: https://datasheet.ciiva.com/7850/1018594-7850022.pdf?src-supplier=Element14; ComponentLink4URL: https://datasheet.ciiva.com/7850/1018594-7850023.pdf?src-supplier=Element14; ComponentLink4Description: https://datasheet.ciiva.com/7850/1018594-7850023.pdf?src-supplier=Element14; ComponentLink5URL: https://datasheet.ciiva.com/15215/getdatasheetpartid-328119-15215035.pdf?src-supplier=Verical; ComponentLink5Description: https://datasheet.ciiva.com/15215/getdatasheetpartid-328119-15215035.pdf?src-supplier=Verical; LCSC Part No.: C105871
R9 R18 R19 = 1K, 16W: RES 1K OHM 1% 1/16W 0402; Manufacturer: Yageo; Manufacturer Part Number: RC0402FR-071KL; Additional Feature: LASER TRIMMABLE; Power: 62.5mW; Rated Temperature: 70°C; Value: 1kR; Working Voltage: 50V; Temperature Coefficient (ppm/Cel): 100; Package Height: 0.35mm; Package Length: 1mm; Package Width: 0.5mm; Supplier: Digikey; Supplier Part Number: 311-1.00KLRCT-ND; RoHS: Yes; Category: Chip SMD Resistors; Stock: 2395421; Pricing: 1=0.1, 10=0.007, 100=0.0061, 1000=0.0051, 2500=0.00408 (USD); Mounting Technology: Surface Mount; Pins: 2; Package Shape: Rectangular; Case/Package: 0402; Terminal Finish: Nickel; Min Operating Temperature: -55°C; Max Operating Temperature: 155°C; Tolerance: 1%; JESD-609 Code: e3; Resistor Type: FIXED RESISTOR; Construction: Chip; Packaging: Tape and Reel; Technology: METAL GLAZE/THICK FILM; Termination: Wraparound; Reach SVHC Compliant: Yes; RoHS Compliant: Yes; ComponentLink1URL: https://datasheet.ciiva.com:443/pdfs/VipMasterIC/IC/YAGO/YAGO-S-A0008145938/YAGO-S-A0008145938-1.pdf?src-supplier=IHS+Markit; ComponentLink1Description: https://datasheet.ciiva.com:443/pdfs/VipMasterIC/IC/YAGO/YAGO-S-A0008145938/YAGO-S-A0008145938-1.pdf?src-supplier=IHS+Markit; ComponentLink2URL: https://datasheet.ciiva.com/11819/0900766b80c66297-11819477.pdf?src-supplier=Rs; ComponentLink2Description: https://datasheet.ciiva.com/11819/0900766b80c66297-11819477.pdf?src-supplier=Rs; ComponentLink3URL: https://datasheet.ciiva.com/22747/1018594-22747513.pdf?src-supplier=Element14; ComponentLink3Description: https://datasheet.ciiva.com/22747/1018594-22747513.pdf?src-supplier=Element14; ComponentLink4URL: https://datasheet.ciiva.com/12666/pyu-rc0402-51-rohs-l-6-r-12666741.pdf?src-supplier=Mouser; ComponentLink4Description: https://datasheet.ciiva.com/12666/pyu-rc0402-51-rohs-l-6-r-12666741.pdf?src-supplier=Mouser; ComponentLink5URL: https://datasheet.ciiva.com/17063/pyu-rc0402-51-rohs-l-6-r-17063193.pdf?src-supplier=Future+Electronics; ComponentLink5Description: https://datasheet.ciiva.com/17063/pyu-rc0402-51-rohs-l-6-r-17063193.pdf?src-supplier=Future+Electronics; LCSC Part No.: C106235
R10 R11 R13 R14 R20 R23-R25 = 10K: Res Thick Film 0402 10K Ohm 5% 0.125W(1/8W) ±200ppm/C Pad SMD T/R; Manufacturer: Yageo Group; Manufacturer Part Number: RC0402JR-7W10KL; Supplier: Digikey; Supplier Part Number: 13-RC0402JR-7W10KLCT-ND; RoHS: No; Category: Chip SMD Resistors; Stock: 1644; Pricing: 1=0.1, 10=0.008, 25=0.0076, 50=0.0072, 100=0.0061, 250=0.0056, 500=0.0051, 5000=0.00375 (USD); LCSC Part No.: C851859
R12 = 2.4k: RES SMD 2.4K OHM 1% 1/16W 0402; Manufacturer: Samsung; Manufacturer Part Number: RC1005F242CS; Power: 60mW; Value: 2.4kR; Working Voltage: 50V; Temperature Coefficient (ppm/Cel): 100; Package Height: 0.35mm; Package Length: 1mm; Package Width: 0.5mm; Supplier: Digikey; Supplier Part Number: 1276-4050-1-ND; RoHS: Yes; Category: Chip SMD Resistors; Stock: 32; Pricing: 1=0.1, 10=0.039 (USD); Mounting Technology: Surface Mount; Pins: 2; Package Shape: Rectangular; Case/Package: 0402; Terminal Finish: Nickel; Min Operating Temperature: -55°C; Max Operating Temperature: 125°C; Tolerance: 1%; JESD-609 Code: e3; Resistor Type: FIXED RESISTOR; Construction: Chip; Packaging: Tape and Reel; Technology: METAL GLAZE/THICK FILM; Reach SVHC Compliant: Yes; RoHS Compliant: Yes; ComponentLink1URL: https://datasheet.ciiva.com:443/pdfs/VipMasterIC/IC/SEMS/SEMS-S-A0001326806/SEMS-S-A0001326806-1.pdf?src-supplier=IHS+Markit; ComponentLink1Description: https://datasheet.ciiva.com:443/pdfs/VipMasterIC/IC/SEMS/SEMS-S-A0001326806/SEMS-S-A0001326806-1.pdf?src-supplier=IHS+Markit; ComponentLink2URL: https://datasheet.ciiva.com/26184/chip-resistor-150112-1-26184966.pdf?src-supplier=Digikey; ComponentLink2Description: https://datasheet.ciiva.com/26184/chip-resistor-150112-1-26184966.pdf?src-supplier=Digikey; LCSC Part No.: C17345684
R15 = 249k ohm: 249 kOhms ±1% 0.063W, 1/16W Chip Resistor 0402 (1005 Metric) Moisture Resistant Thick Film; Manufacturer: Yageo; Manufacturer Part Number: RC0402FR-07249KL; Additional Feature: LASER TRIMMABLE; Power: 62.5mW; Rated Temperature: 70°C; Value: 249kR; Working Voltage: 50V; Temperature Coefficient (ppm/Cel): 100; Package Height: 0.35mm; Package Length: 1mm; Package Width: 0.5mm; Supplier: Digikey; Supplier Part Number: 311-249KLRCT-ND; RoHS: Yes; Category: Chip SMD Resistors; Stock: 71596; Pricing: 1=0.1, 10=0.008, 25=0.006, 50=0.004, 100=0.0033 (USD); Mounting Technology: Surface Mount; Pins: 2; Package Shape: Rectangular; Case/Package: 0402; Terminal Finish: Nickel; Min Operating Temperature: -55°C; Max Operating Temperature: 155°C; Tolerance: 1%; JESD-609 Code: e3; Resistor Type: FIXED RESISTOR; Construction: Chip; Packaging: Tape and Reel; Technology: METAL GLAZE/THICK FILM; Termination: Wraparound; Reach SVHC Compliant: Yes; RoHS Compliant: Yes; ComponentLink1URL: https://datasheet.ciiva.com:443/pdfs/VipMasterIC/IC/YAGO/YAGO-S-A0008145938/YAGO-S-A0008145938-1.pdf?src-supplier=IHS+Markit; ComponentLink1Description: https://datasheet.ciiva.com:443/pdfs/VipMasterIC/IC/YAGO/YAGO-S-A0008145938/YAGO-S-A0008145938-1.pdf?src-supplier=IHS+Markit; ComponentLink2URL: https://datasheet.ciiva.com/12656/pyu-rc0402-51-rohs-l-6-r-12656622.pdf?src-supplier=Mouser; ComponentLink2Description: https://datasheet.ciiva.com/12656/pyu-rc0402-51-rohs-l-6-r-12656622.pdf?src-supplier=Mouser; ComponentLink3URL: https://datasheet.ciiva.com/2519/pyu-r-int-thick-7-2519006.pdf?src-supplier=Digikey; ComponentLink3Description: https://datasheet.ciiva.com/2519/pyu-r-int-thick-7-2519006.pdf?src-supplier=Digikey; ComponentLink4URL: https://datasheet.ciiva.com/2519/pyu-r-int-thick-7-2519007.pdf?src-supplier=Digikey; ComponentLink4Description: https://datasheet.ciiva.com/2519/pyu-r-int-thick-7-2519007.pdf?src-supplier=Digikey; ComponentLink5URL: https://datasheet.ciiva.com/2519/pyu-r-int-thick-7-2519008.pdf?src-supplier=Digikey; ComponentLink5Description: https://datasheet.ciiva.com/2519/pyu-r-int-thick-7-2519008.pdf?src-supplier=Digikey; ComponentLink6URL: https://datasheet.ciiva.com/17071/pyu-rc0402-51-rohs-l-6-r-17071292.pdf?src-supplier=Future+Electronics; ComponentLink6Description: https://datasheet.ciiva.com/17071/pyu-rc0402-51-rohs-l-6-r-17071292.pdf?src-supplier=Future+Electronics; ComponentLink7URL: https://datasheet.ciiva.com/8886/pyu-rc0402-51-rohs-l-6-8886568.pdf?src-supplier=Avnet; ComponentLink7Description: https://datasheet.ciiva.com/8886/pyu-rc0402-51-rohs-l-6-8886568.pdf?src-supplier=Avnet; LCSC Part No.: C163476
R16 R17 = 22R: RES 22 OHM 5% 1/8W 0402; Manufacturer: Yageo Group; Manufacturer Part Number: AC0402JR-7W22RL; Power Dissipation: 125mW; Value: 22Ω; Temperature Coefficient: 100ppm/°C; Voltage Rating: 50V; Working Voltage: 75V; Supplier: DigiKey; Supplier Part Number: 13-AC0402JR-7W22RLCT-ND; RoHS: Compliant; Category: Chip SMD Resistors; Stock: 1738; Pricing: 1=0.15, 10=0.014, 25=0.0124, 50=0.0102, 100=0.0092, 250=0.00724, 1000=0.00609, 5000=0.00431 (USD); Case/Package: 0402; China RoHS: Non-Compliant; Composition: Thick Film; Height: 320µm; Lifecycle Status: Production; Max Operating Temperature: 155°C; Min Operating Temperature: -55°C; Mounting Technology: Surface Mount; Number of Terminals: 2; Packaging: Tape & Reel; Power Rating: 125mW; REACH SVHC: Yes; Tolerance: 5%; Width: 500µm; ComponentLink1URL: https://datasheet.octopart.com:443/AC0402JR-7W22RL-Yageo-datasheet-182189377.pdf?src-supplier=IHS; ComponentLink1Description: https://datasheet.octopart.com:443/AC0402JR-7W22RL-Yageo-datasheet-182189377.pdf?src-supplier=IHS; ComponentLink2URL: https://datasheet.octopart.com:443/AC0402JR-7W22RL-Yageo-datasheet-83209224.pdf?src-supplier=Upverter; ComponentLink2Description: https://datasheet.octopart.com:443/AC0402JR-7W22RL-Yageo-datasheet-83209224.pdf?src-supplier=Upverter; ComponentLink3URL: https://datasheet.octopart.com:443/AC0402JR-7W22RL-Yageo-datasheet-178509465.pdf?src-supplier=Farnell; ComponentLink3Description: https://datasheet.octopart.com:443/AC0402JR-7W22RL-Yageo-datasheet-178509465.pdf?src-supplier=Farnell; ComponentLink4URL: https://datasheet.octopart.com:443/AC0402JR-7W22RL-Yageo-Group-datasheet-164768995.pdf?src-supplier=ODG+(Origin+Data+Global); ComponentLink4Description: https://datasheet.octopart.com:443/AC0402JR-7W22RL-Yageo-Group-datasheet-164768995.pdf?src-supplier=ODG+(Origin+Data+Global); ComponentLink5URL: https://datasheet.octopart.com/AC0402JR-7W22RL-Yageo-datasheet-12512238.pdf; ComponentLink5Description: https://datasheet.octopart.com/AC0402JR-7W22RL-Yageo-datasheet-12512238.pdf; ComponentLink6URL: http://sigma.octopart.com:80/rohs_statement/Yageo-company-2.pdf?src-supplier=Compliance+Statements; ComponentLink6Description: http://sigma.octopart.com:80/rohs_statement/Yageo-company-2.pdf?src-supplier=Compliance+Statements; ComponentLink7URL: http://sigma.octopart.com:80/conflict_mineral_statement/Yageo-company-3.pdf?src-supplier=Compliance+Statements; ComponentLink7Description: http://sigma.octopart.com:80/conflict_mineral_statement/Yageo-company-3.pdf?src-supplier=Compliance+Statements; LCSC Part No.: C6117700
SW1-SW4 = SKRPANE010: Tactile Switch SPST-NO Top Actuated Surface Mount; Manufacturer: ALPS; Contact Resistance: 500mΩ; Electrical Life: 1Mcycles; Insulation Resistance: 100MΩ; Max Current Rating: 50mA; Max Voltage Rating (DC): 16V; Number of Positions: 1; Operating Force: 1.57N; Throw Configuration: SPST; Supplier: DigiKey; Supplier Part Number: 4809-SKRPANE010CT-ND; Manufacturer Part Number: SKRPANE010; RoHS: Compliant; Category: Tactile Switches; Stock: 7681; Pricing: 1=0.27, 10=0.238, 25=0.2232, 50=0.2114, 100=0.2, 250=0.1854, 500=0.17496, 1000=0.16517 (USD); Color: Natural; Height: 1.6mm; Length: 4.2mm; Lifecycle Status: Production; Max Operating Temperature: 85°C; Min Operating Temperature: -30°C; ComponentLink1URL: https://datasheet.octopart.com:443/SKRPANE010-ALPS-datasheet-182235269.pdf?src-supplier=IHS; ComponentLink1Description: https://datasheet.octopart.com:443/SKRPANE010-ALPS-datasheet-182235269.pdf?src-supplier=IHS; ComponentLink2URL: https://datasheet.octopart.com:443/SKRPANE010-ALPS-datasheet-103684837.pdf?src-supplier=Electro+Sonic; ComponentLink2Description: https://datasheet.octopart.com:443/SKRPANE010-ALPS-datasheet-103684837.pdf?src-supplier=Electro+Sonic; LCSC Part No.: C470426